# Altium schematic sheet Sheet1.SchDoc: =Name-1str
size 840 x 594 mm; SheetNumber: номер страницы; Вид изделия: Документация; Раздел: Документация; Код документа: Э3; Вид документа: Схема электрическая принципиальная; Класс документа: Конструкторский документ; Создавать изделие в PLM: Yes; DocumentCode: Э3; DocumentView: Схема электрическая принципиальная; DocumentClass: Конструкторский документ; ProductView: Документация
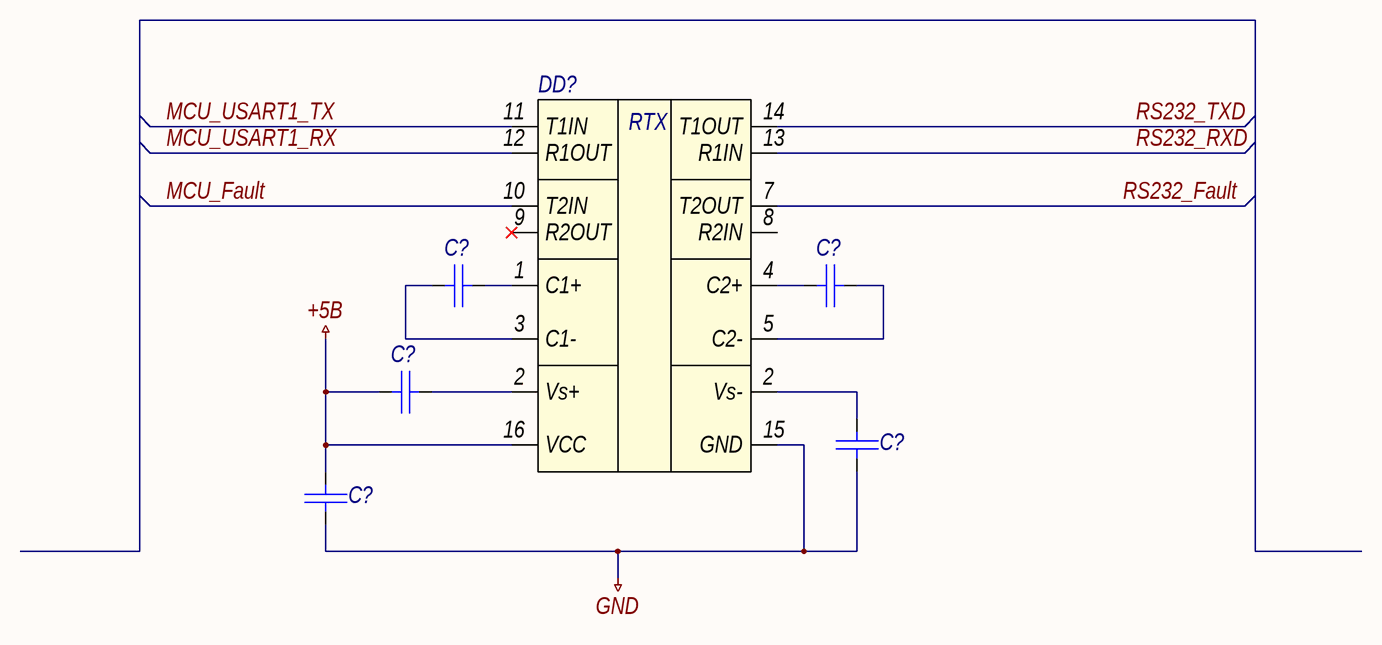
[diagram p0: Sheet1.SchDoc]

## Parts
(Parts that share a designator on the sheet are numbered #1, #2 ... from top to bottom, then left to right.)
C?#1  (no value)  [C0805_AA]
C?#2  (no value)  [C0805_AA]
C?#3  (no value)  [C0805_AA]
C?#4  (no value)  [C0805_AA]
C?#5  (no value)  [C0805_AA]
DD?  (no value)

## Nets
+5В: C?#3.1 C?#5.2 DD?.16(VCC)
GND: C?#4.2 C?#5.1 DD?.15(GND)
MCU_Fault: DD?.10(T2IN)
MCU_USART1_RX: DD?.12(R1OUT)
MCU_USART1_TX: DD?.11(T1IN)
RS232_Fault: DD?.7(T2OUT)
RS232_RXD: DD?.13(R1IN)
RS232_TXD: DD?.14(T1OUT)
NetC?#1_1: C?#1.1 DD?.1(C1+)
NetC?#1_2: C?#1.2 DD?.3(C1-)
NetC?#2_1: C?#2.1 DD?.4(C2+)
NetC?#2_2: C?#2.2 DD?.5(C2-)
NetC?#3_2: C?#3.2 DD?.2(Vs+)
NetC?#4_1: C?#4.1 DD?.2(Vs-)

Not connected (* = marked no-connect by the designer): DD? 8(R2IN) 9(R2OUT)*

## Notes on the sheet
- Подп. и дата
- Инв. № дубл.
- Взам. инв. №
- Инв. № подл.
- Лист
- Изм.
- № докум.
- Подп.
- Дата
- Копировал
- Формат
- (in symbol MAX232ID) RTX

## Library data of the parts
C?#1-C?#5 = Конденсатор кер.
DD? = MAX232ID: Dual EIA-232 Drivers/Receivers